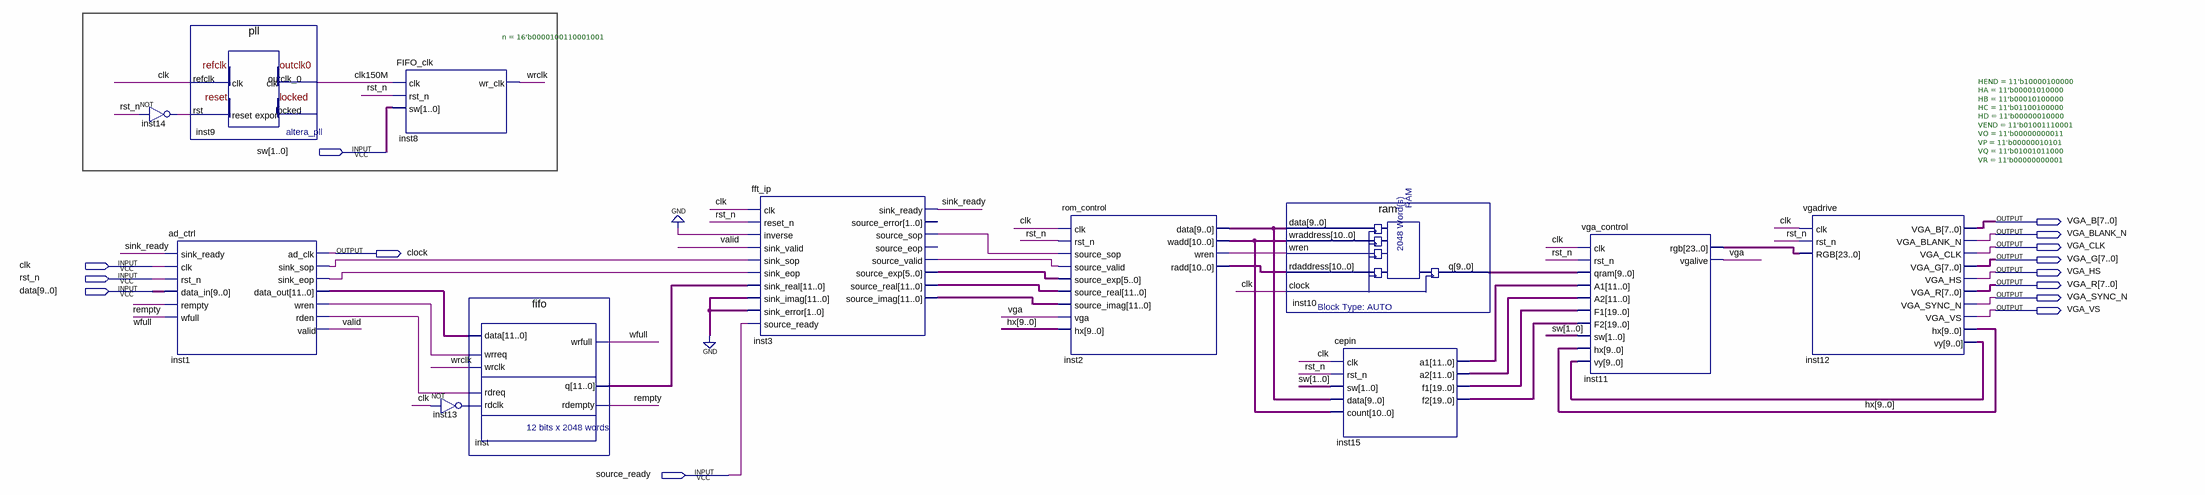
[diagram p0: schematic sheet]
// Quartus schematic vga_fft.bdf as structural Verilog: 12 symbols, 14 pins
module vga_fft (
  input  [1:0] sw,
  input  clk,
  input  rst_n,
  input  [9:0] data,
  input  source_ready,
  output [7:0] VGA_B,
  output VGA_BLANK_N,
  output VGA_CLK,
  output clock,
  output [7:0] VGA_G,
  output VGA_HS,
  output [7:0] VGA_R,
  output VGA_SYNC_N,
  output VGA_VS
);

  wire clk150M, inst1_rden, inst1_sink_eop, inst1_sink_sop, inst1_wren, inst2_wren, inst3_source_sop,
       inst3_source_valid, inst13_out, inst14_out, rempty, sink_ready, valid, vga, wfull, wrclk;
  wire [5:0] inst3_source_exp;
  wire [9:0] hx, inst2_data, inst10_q, inst12_vy;
  wire [10:0] inst2_radd, inst2_wadd;
  wire [11:0] inst1_data_out, inst3_source_imag, inst3_source_real, inst15_a1, inst15_a2, inst_q;
  wire [19:0] inst15_f1, inst15_f2;
  wire [23:0] inst11_rgb;

  not inst14 (inst14_out, rst_n);
  ad_ctrl inst1 (
    .sink_ready(sink_ready), .clk(clk), .rst_n(rst_n), .data_in(data), .rempty(rempty), .wfull(wfull),
    .ad_clk(clock), .sink_sop(inst1_sink_sop), .sink_eop(inst1_sink_eop), .data_out(inst1_data_out),
    .wren(inst1_wren), .rden(inst1_rden), .valid(valid));
  pll inst9 (.refclk(clk), .rst(inst14_out), .outclk_0(clk150M));  // open: locked
  FIFO_clk #(.n(16'b0000100110001001)) inst8 (.clk(clk150M), .rst_n(rst_n), .sw(sw), .wr_clk(wrclk));
  fifo inst (
    .data(inst1_data_out), .wrreq(inst1_wren), .wrclk(wrclk), .rdreq(inst1_rden), .rdclk(inst13_out),
    .wrfull(wfull), .q(inst_q), .rdempty(rempty));
  not inst13 (inst13_out, clk);
  fft_ip inst3 (
    .clk(clk), .reset_n(rst_n), .inverse(1'b0), .sink_valid(valid), .sink_sop(inst1_sink_sop),
    .sink_eop(inst1_sink_eop), .sink_real(inst_q), .sink_imag({12{1'b0}}), .sink_error({12{1'b0}}),
    .source_ready(source_ready), .sink_ready(sink_ready), .source_sop(inst3_source_sop),
    .source_valid(inst3_source_valid), .source_exp(inst3_source_exp), .source_real(inst3_source_real),
    .source_imag(inst3_source_imag));  // open: source_error, source_eop
  rom_control inst2 (
    .clk(clk), .rst_n(rst_n), .source_sop(inst3_source_sop), .source_valid(inst3_source_valid),
    .source_exp(inst3_source_exp), .source_real(inst3_source_real), .source_imag(inst3_source_imag),
    .vga(vga), .hx(hx), .data(inst2_data), .wadd(inst2_wadd), .wren(inst2_wren), .radd(inst2_radd));
  ram inst10 (
    .data(inst2_data), .wraddress(inst2_wadd), .wren(inst2_wren), .rdaddress(inst2_radd), .clock(clk),
    .q(inst10_q));
  cepin inst15 (
    .clk(clk), .rst_n(rst_n), .sw(sw), .data(inst2_data), .count(inst2_wadd), .a1(inst15_a1), .a2(inst15_a2),
    .f1(inst15_f1), .f2(inst15_f2));
  vga_control inst11 (
    .clk(clk), .rst_n(rst_n), .qram(inst10_q), .A1(inst15_a1), .A2(inst15_a2), .F1(inst15_f1),
    .F2(inst15_f2), .sw(sw), .hx(hx), .vy(inst12_vy), .rgb(inst11_rgb), .vgalive(vga));
  vgadrive #(.HEND(11'b10000100000), .HA(11'b00001010000), .HB(11'b00010100000), .HC(11'b01100100000), .HD(11'b00000010000), .VEND(11'b01001110001), .VO(11'b00000000011), .VP(11'b00000010101), .VQ(11'b01001011000), .VR(11'b00000000001)) inst12 (
    .clk(clk), .rst_n(rst_n), .RGB(inst11_rgb), .VGA_B(VGA_B), .VGA_BLANK_N(VGA_BLANK_N), .VGA_CLK(VGA_CLK),
    .VGA_G(VGA_G), .VGA_HS(VGA_HS), .VGA_R(VGA_R), .VGA_SYNC_N(VGA_SYNC_N), .VGA_VS(VGA_VS), .hx(hx),
    .vy(inst12_vy));
endmodule
